# Altium schematic sheet USB_Connector.SchDoc: USB Connector
size A4
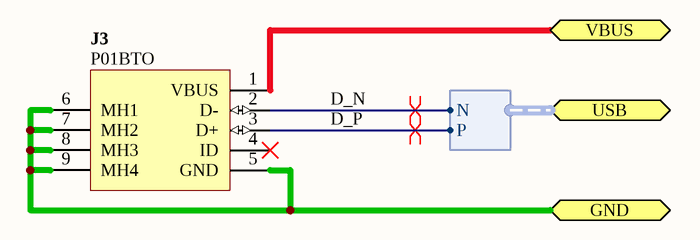
[diagram p0: USB_Connector.SchDoc]

## Parts
J3  P01BTO  [Qiwei-SMD]

## Ports
GND, USB (harness USB), VBUS

## Harnesses
USB: N, P

## Nets
D_N: J3.2(D-) ; port USB.N
D_P: J3.3(D+) ; port USB.P
GND: J3.5(GND) J3.6(MH1) J3.7(MH2) J3.8(MH3) J3.9(MH4) ; port GND
VBUS: J3.1(VBUS) ; port VBUS

Not connected (* = marked no-connect by the designer): J3 4(ID)*

## Layout directives
differential pair: D_N, D_P

## Notes on the sheet
- Sheet Title
- Project Title
- Size:
- Date:
- A4
- Item:
- Time:
- Revision:
- Sheet
- of
- File:

## Library data of the parts
J3 = CMP-5172-00001-1: Connector Mini USB, Right Angle, Receptacle; IEC-class: Connectors; Sub-class: Serial Bus; Class: Connector